# EasyEDA schematic SCH_CJ4 Electrical Panel.json
TITLE: CJ4 Electrical Panel; REV: 1.0; Date: 2021-06-11; Sheet: 1/1; Drawn By: Tuomas Kuosmanen; Company: Your Company
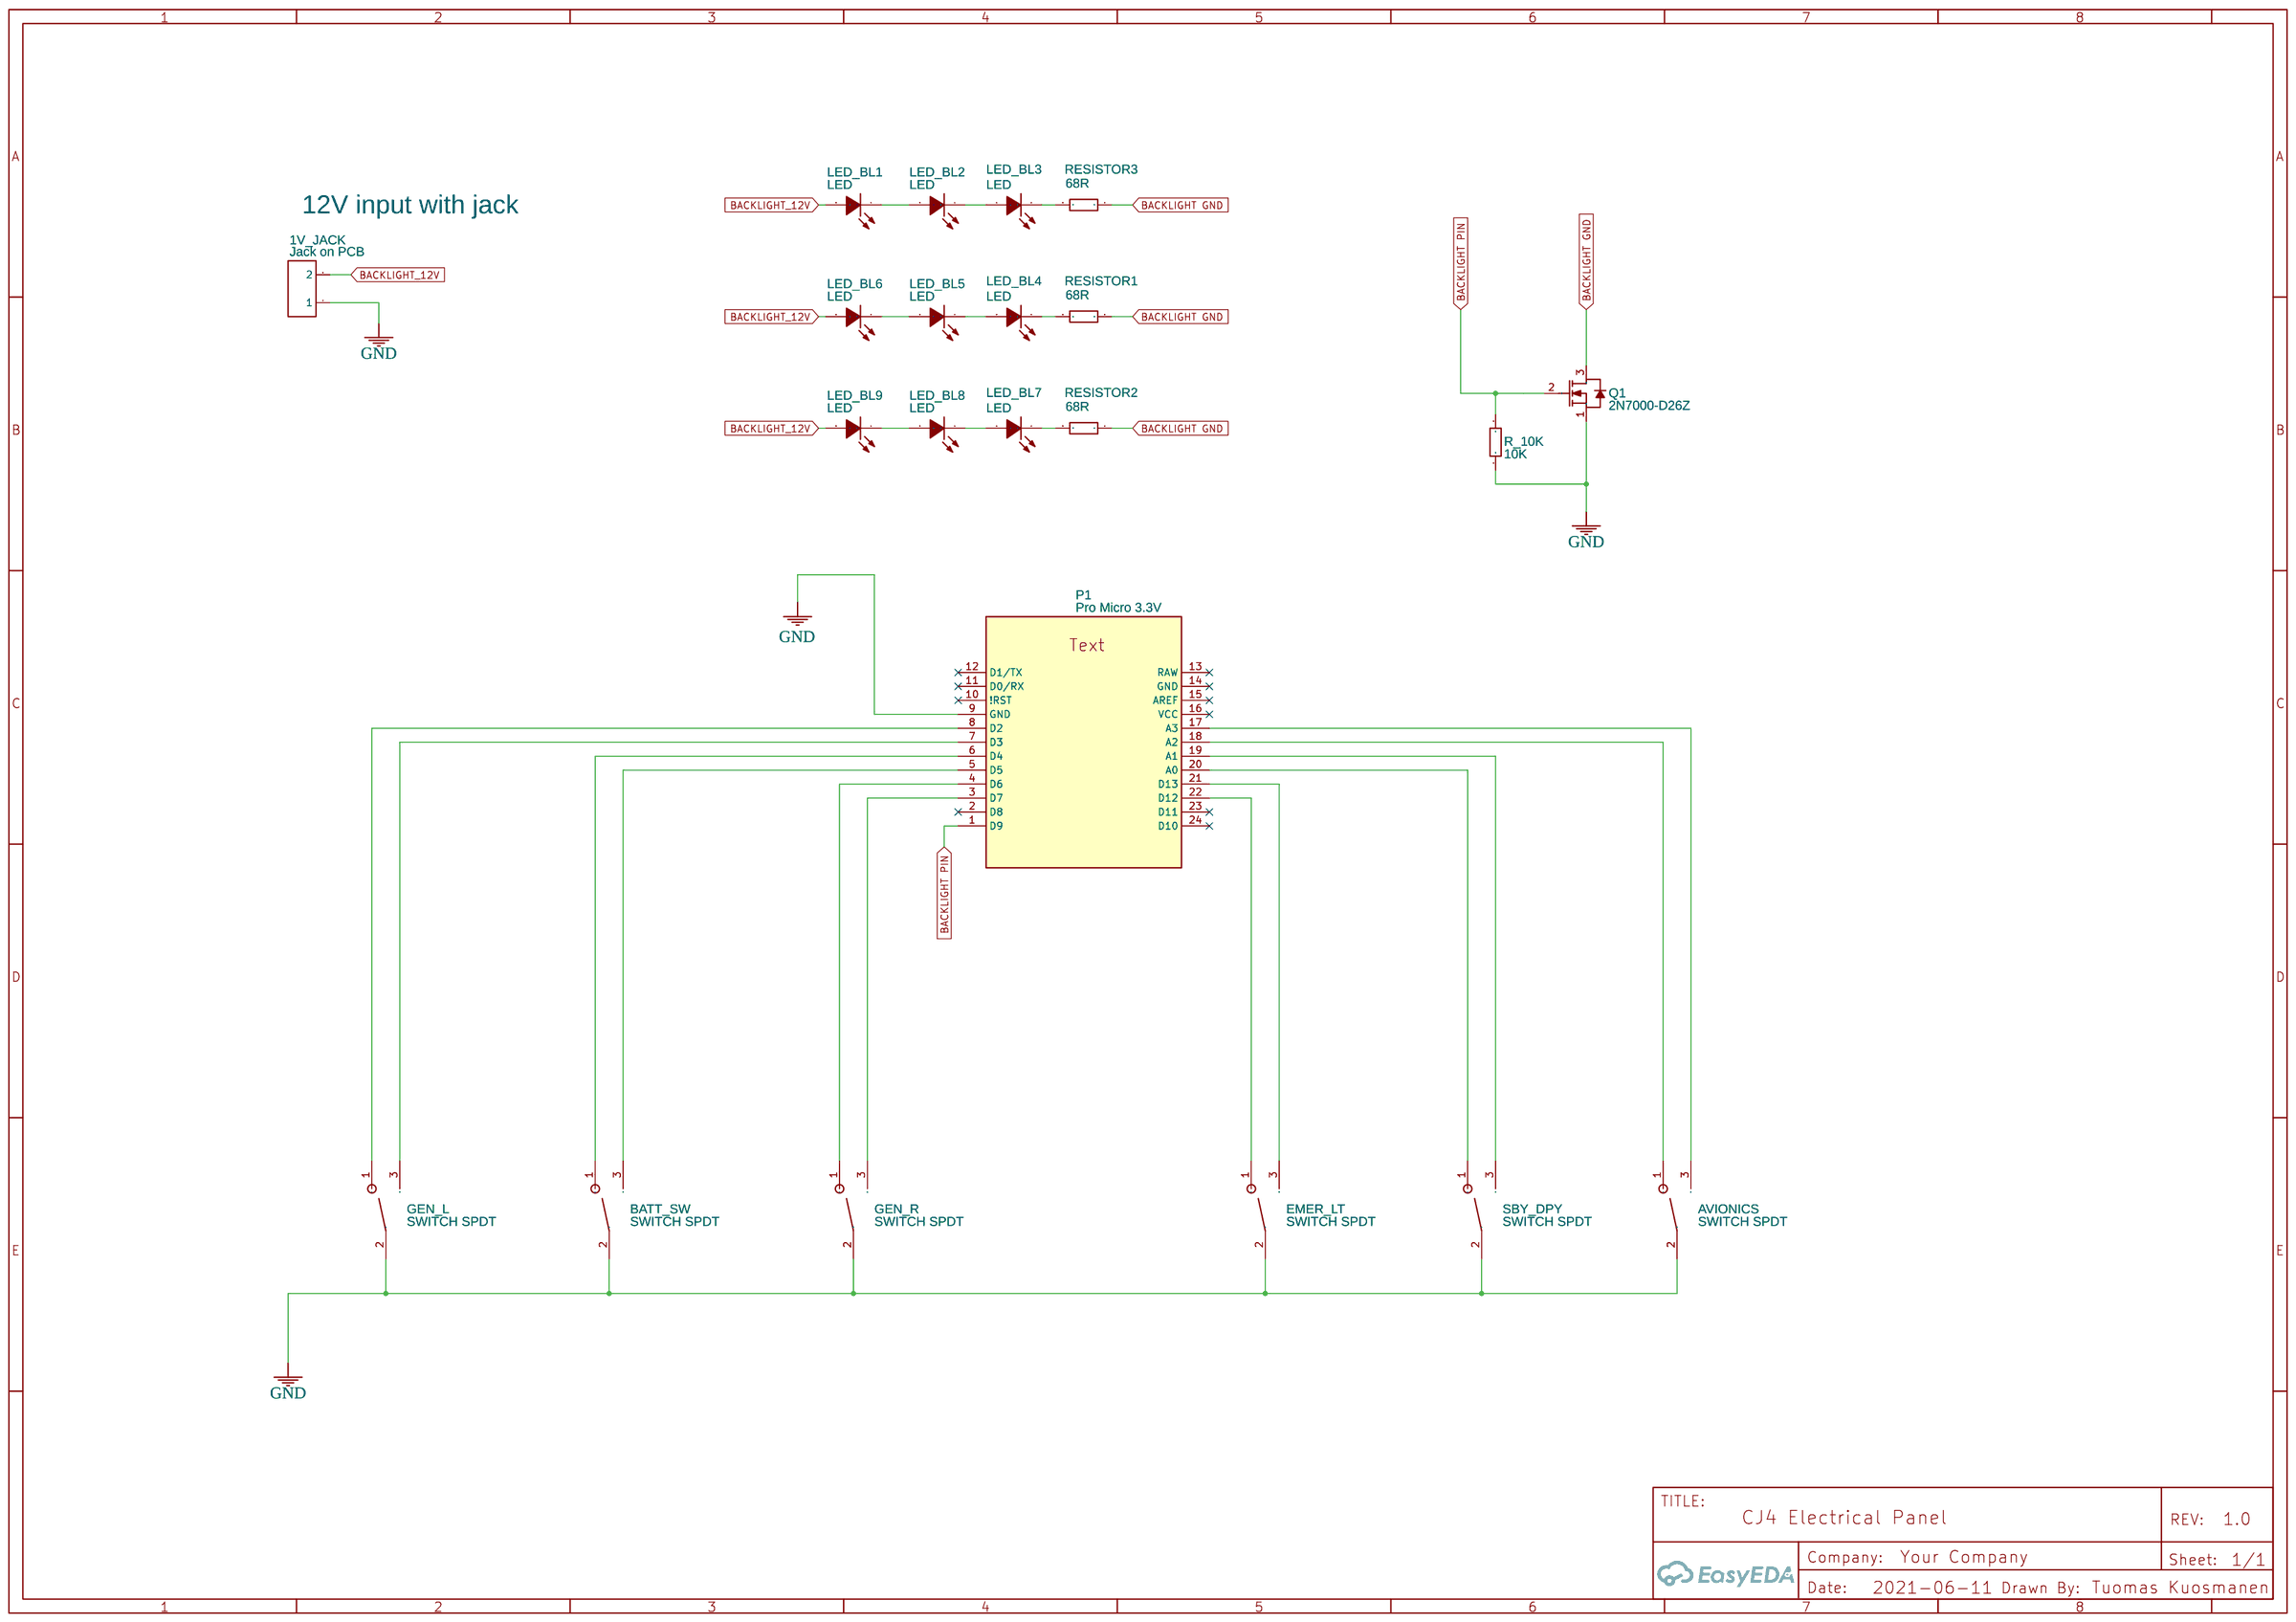
[diagram p0: schematic sheet]

## Parts
1V_JACK  Jack on PCB  [JACK ON PCB]
AVIONICS  SWITCH SPDT  [SWITCH_SALECOM_T8013_SEBQ_H]
BATT_SW  SWITCH SPDT  [SWITCH_SALECOM_T8013_SEBQ_H]
EMER_LT  SWITCH SPDT  [SWITCH_SALECOM_T8013_SEBQ_H]
GEN_L  SWITCH SPDT  [SWITCH_SALECOM_T8013_SEBQ_H]
GEN_R  SWITCH SPDT  [SWITCH_SALECOM_T8013_SEBQ_H]
LED_BL1  LED  [LED1206-RD]
LED_BL2  LED  [LED1206-RD]
LED_BL3  LED  [LED1206-RD]
LED_BL4  LED  [LED1206-RD]
LED_BL5  LED  [LED1206-RD]
LED_BL6  LED  [LED1206-RD]
LED_BL7  LED  [LED1206-RD]
LED_BL8  LED  [LED1206-RD]
LED_BL9  LED  [LED1206-RD]
P1  Pro Micro 3.3V  [PRO MICRO 3.3V]
Q1  2N7000-D26Z  [TO-92-3_L4.8-W3.7-P2.54-L]
R_10K  10K  [R1206]
RESISTOR1  68R  [R1206]
RESISTOR2  68R  [R1206]
RESISTOR3  68R  [R1206]
SBY_DPY  SWITCH SPDT  [SWITCH_SALECOM_T8013_SEBQ_H]

## Library data of the parts
1V_JACK = J-Header-Male-2.54_1x2: Manufacturer: TE Connectivity; image: //image.lceda.cn/szlcsc/C86471.jpg; link: //image.lceda.cn/szlcsc/C86471.jpg; Package Display: No
AVIONICS BATT_SW EMER_LT GEN_L GEN_R SBY_DPY = SWITCH SPDT: Supplier: LCSC; Supplier Part: C273365; Manufacturer: E-Switch; Manufacturer Part: 200MSP1T1B1M2QEH; Contributor: LCSC
LED_BL1-LED_BL9 = HQ17-2102UYOC: Supplier: LCSC; Manufacturer: HARVATEK; Contributor: LCSC; Supplier Part: C154481; JLCPCB Part Class: Extended Part
P1 = Pro Micro 3.3V: sourceId: UbZz96Gge; Supplier Part: 12587; Supplier: SparkFun
Q1 = 2N7000-D26Z: Supplier: LCSC; Supplier Part: C258193; Manufacturer: ON Semicon; Contributor: LCSC; JLCPCB Part Class: Extended Part
R_10K RESISTOR1-RESISTOR3 = 1206W4J0331T5E: Supplier: LCSC; Manufacturer: UniOhm; Supplier Part: C25374

## Nets
GND: 1V_JACK.1 AVIONICS.2 BATT_SW.2 EMER_LT.2 GEN_L.2 GEN_R.2 P1.9(GND) Q1.1(S) R_10K.1 SBY_DPY.2
BACKLIGHT GND: Q1.3(D) RESISTOR1.1 RESISTOR2.1 RESISTOR3.1
BACKLIGHT PIN: P1.1(D9) Q1.2(G) R_10K.2
BACKLIGHT_12V: 1V_JACK.2 LED_BL1.2(A) LED_BL6.2(A) LED_BL9.2(A)
Net-(AVIONICS-1): AVIONICS.1 P1.18(A2)
Net-(AVIONICS-3): AVIONICS.3 P1.17(A3)
Net-(BATT_SW-1): BATT_SW.1 P1.6(D4)
Net-(BATT_SW-3): BATT_SW.3 P1.5(D5)
Net-(EMER_LT-1): EMER_LT.1 P1.22(D12)
Net-(EMER_LT-3): EMER_LT.3 P1.21(D13)
Net-(GEN_L-1): GEN_L.1 P1.8(D2)
Net-(GEN_L-3): GEN_L.3 P1.7(D3)
Net-(GEN_R-1): GEN_R.1 P1.4(D6)
Net-(GEN_R-3): GEN_R.3 P1.3(D7)
Net-(LED_BL1-1): LED_BL1.1(K) LED_BL2.2(A)
Net-(LED_BL2-1): LED_BL2.1(K) LED_BL3.2(A)
Net-(LED_BL3-1): LED_BL3.1(K) RESISTOR3.2
Net-(LED_BL4-1): LED_BL4.1(K) RESISTOR1.2
Net-(LED_BL4-2): LED_BL4.2(A) LED_BL5.1(K)
Net-(LED_BL5-2): LED_BL5.2(A) LED_BL6.1(K)
Net-(LED_BL7-1): LED_BL7.1(K) RESISTOR2.2
Net-(LED_BL7-2): LED_BL7.2(A) LED_BL8.1(K)
Net-(LED_BL8-2): LED_BL8.2(A) LED_BL9.1(K)
Net-(P1-19): P1.19(A1) SBY_DPY.3
Net-(P1-20): P1.20(A0) SBY_DPY.1

Not connected (* = marked no-connect by the designer): P1 2(D8)* 10(!RST)* 11(D0/RX)* 12(D1/TX)* 13(RAW)* 14(GND)* 15(AREF)* 16(VCC)* 23(D11)* 24(D10)*

## Notes on the sheet
- 12V input with jack
